# EAGLE schematic tiny_tht_encoder_board (EAGLE 9.4.2)

## Sheet 1 of 3
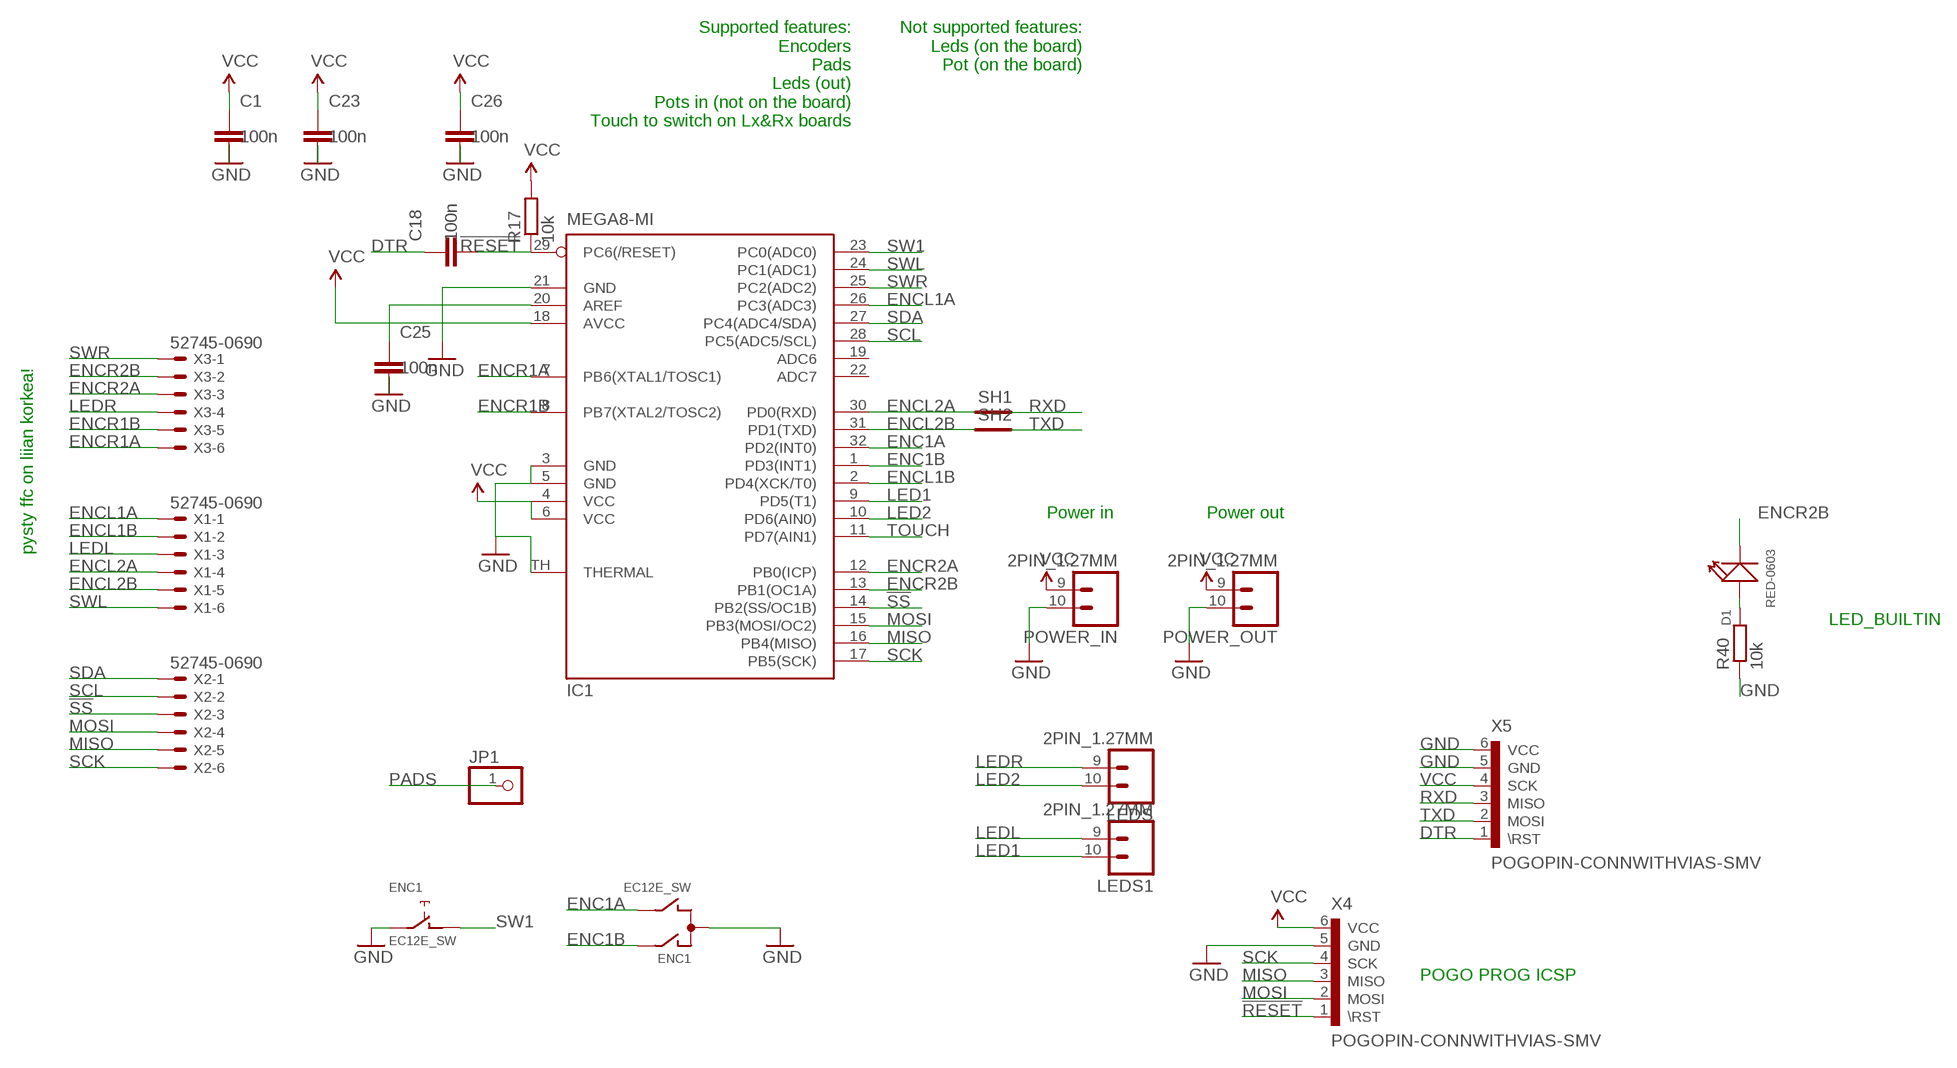
[diagram p0: schematic, sheet 1]

### Parts
C1  100n  C-EUC0402  [C0402]
C18  100n  C-EUC0402  [C0402]
C23  100n  C-EUC0402  [C0402]
C25  100n  C-EUC0402  [C0402]
C26  100n  C-EUC0402  [C0402]
D1  RED-0603  LED-SMD-RED-DIFFUSED(0603)  [LED-0603]
ENC1  EC12E_SW  [ALPS_EC12E_SW]
IC1  MEGA8-MI  [MLF32-TH]
JP1  PINHD-1X1  [1X01]
LEDS  2PIN_1.27MM  [1X02_1.27MM_NO_SILK]
LEDS1  2PIN_1.27MM  [1X02_1.27MM_NO_SILK]
POWER_IN  2PIN_1.27MM  [1X02_1.27MM_NO_SILK]
POWER_OUT  2PIN_1.27MM  [1X02_1.27MM_NO_SILK]
R17  10k  R-EU_R0402  [R0402]
R40  10k  R-EU_R0402  [R0402]
SH1  SHORT  [SHORT_TOP_8MIL]
SH2  SHORT  [SHORT_TOP_8MIL]
X1  52745-0690  [52745-0690]
X2  52745-0690  [52745-0690]
X3  52745-0690  [52745-0690]
X4  POGOPIN-CONNWITHVIAS-SMV  [POGOPROG-CONN-OH-SMALLERVIAS]
X5  POGOPIN-CONNWITHVIAS-SMV  [POGOPROG-CONN-OH-SMALLERVIAS]

### Nets
!RESET: C18.2 IC1.29(PC6(/RESET)) R17.1 X4.1(\RST)
!SS: IC1.14(PB2(SS/OC1B)) X2.3
AREF: C25.1 IC1.20(AREF)
DTR: C18.1 X5.1(\RST)
ENC1A: ENC1.B IC1.32(PD2(INT0)) ; also sheet 3
ENC1B: ENC1.A IC1.1(PD3(INT1)) ; also sheet 3
ENCL1A: IC1.26(PC3(ADC3)) X1.1 ; also sheet 3
ENCL1B: IC1.2(PD4(XCK/T0)) X1.2 ; also sheet 3
ENCL2A: IC1.30(PD0(RXD)) SH1.P$1 X1.4 ; also sheet 3
ENCL2B: IC1.31(PD1(TXD)) SH2.P$1 X1.5 ; also sheet 3
ENCR1A: IC1.7(PB6(XTAL1/TOSC1)) X3.6 ; also sheet 3
ENCR1B: IC1.8(PB7(XTAL2/TOSC2)) X3.5 ; also sheet 3
ENCR2A: IC1.12(PB0(ICP)) X3.3 ; also sheet 3
ENCR2B: D1.- IC1.13(PB1(OC1A)) X3.2 ; also sheet 3
GND: C1.2 C23.2 C25.2 C26.2 ENC1.C ENC1.E IC1.3(GND) IC1.5(GND) IC1.21(GND) IC1.TH(THERMAL) POWER_IN.10 POWER_OUT.10 R40.1 X4.5(GND) X5.5(GND) X5.6(VCC) ; also sheet 2
LED1: IC1.9(PD5(T1)) LEDS1.10
LED2: IC1.10(PD6(AIN0)) LEDS.10
LEDL: LEDS1.9 X1.3
LEDR: LEDS.9 X3.4
MISO: IC1.16(PB4(MISO)) X2.5 X4.3(MISO) ; also sheet 2
MOSI: IC1.15(PB3(MOSI/OC2)) X2.4 X4.2(MOSI) ; also sheet 2
N$31: D1.+ R40.2
PADS: JP1.1 ; also sheet 3
RXD: SH1.P$2 X5.3(MISO)
SCK: IC1.17(PB5(SCK)) X2.6 X4.4(SCK) ; also sheet 2
SCL: IC1.28(PC5(ADC5/SCL)) X2.2
SDA: IC1.27(PC4(ADC4/SDA)) X2.1
SW1: ENC1.D IC1.23(PC0(ADC0)) ; also sheet 3
SWL: IC1.24(PC1(ADC1)) X1.6 ; also sheet 3
SWR: IC1.25(PC2(ADC2)) X3.1 ; also sheet 3
TOUCH: IC1.11(PD7(AIN1))
TXD: SH2.P$2 X5.2(MOSI)
VCC: C1.1 C23.1 C26.1 IC1.4(VCC) IC1.6(VCC) IC1.18(AVCC) POWER_IN.9 POWER_OUT.9 R17.2 X4.6(VCC) X5.4(SCK)
Unconnected: ENC1.GND1(G) ENC1.GND2(G) IC1.19(ADC6) IC1.22(ADC7)

### Notes on the sheet
- Supported features:
  Encoders
  Pads
  Leds (out)
  Pots in (not on the board)
  Touch to switch on Lx&Rx boards
- Not supported features:
  Leds (on the board)
  Pot (on the board)
- Power in | Power out
- pysty ffc on liian korkea!
- LED_BUILTIN
- POGO PROG ICSP

## Sheet 2 of 3
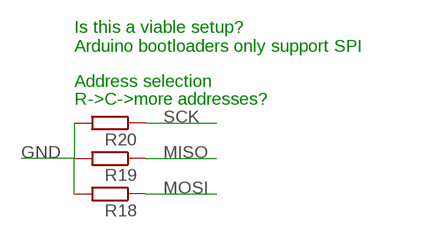
[diagram p1: schematic, sheet 2]

### Parts
R18  R-EU_R0402  [R0402]
R19  R-EU_R0402  [R0402]
R20  R-EU_R0402  [R0402]

### Nets
GND: R18.2 R19.2 R20.2 ; also sheet 1
MISO: R19.1 ; also sheet 1
MOSI: R18.1 ; also sheet 1
SCK: R20.1 ; also sheet 1

### Notes on the sheet
- Is this a viable setup?
  Arduino bootloaders only support SPI
- Address selection
- R->C->more addresses?

## Sheet 3 of 3
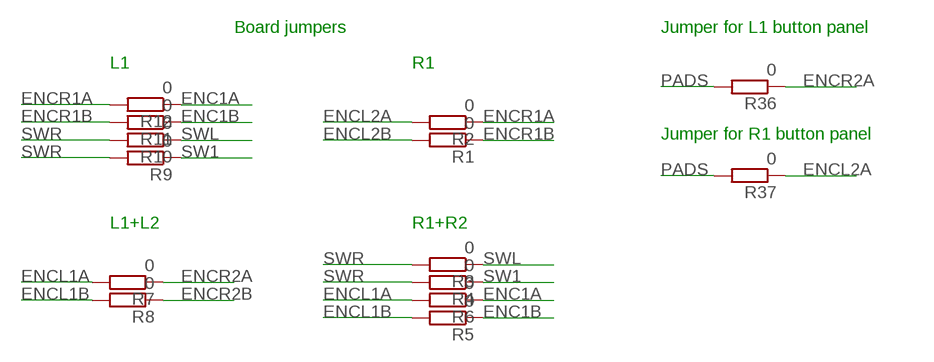
[diagram p2: schematic, sheet 3]

### Parts
R1  0  R-EU_R0603  [R0603]
R2  0  R-EU_R0603  [R0603]
R3  0  R-EU_R0603  [R0603]
R4  0  R-EU_R0603  [R0603]
R5  0  R-EU_R0603  [R0603]
R6  0  R-EU_R0603  [R0603]
R7  0  R-EU_R0603  [R0603]
R8  0  R-EU_R0603  [R0603]
R9  0  R-EU_R0603  [R0603]
R10  0  R-EU_R0603  [R0603]
R11  0  R-EU_R0603  [R0603]
R12  0  R-EU_R0603  [R0603]
R36  0  R-EU_R0402  [R0402]
R37  0  R-EU_R0402  [R0402]

### Nets
ENC1A: R6.1 R12.1 ; also sheet 1
ENC1B: R5.1 R11.1 ; also sheet 1
ENCL1A: R6.2 R7.2 ; also sheet 1
ENCL1B: R5.2 R8.2 ; also sheet 1
ENCL2A: R2.2 R37.1 ; also sheet 1
ENCL2B: R1.2 ; also sheet 1
ENCR1A: R2.1 R12.2 ; also sheet 1
ENCR1B: R1.1 R11.2 ; also sheet 1
ENCR2A: R7.1 R36.1 ; also sheet 1
ENCR2B: R8.1 ; also sheet 1
PADS: R36.2 R37.2 ; also sheet 1
SW1: R4.1 R9.1 ; also sheet 1
SWL: R3.1 R10.1 ; also sheet 1
SWR: R3.2 R4.2 R9.2 R10.2 ; also sheet 1

### Notes on the sheet
- Board jumpers | Jumper for L1 button panel
- L1 | R1
- Jumper for R1 button panel
- L1+L2 | R1+R2

## Library data of the parts
C1 C18 C23 C25 C26 = rcl:C-EU: CAPACITOR, European symbol; SPICEPREFIX: C
D1 = Seeed-LED-2016:LED-SMD-RED-DIFFUSED(0603): 304090042; MPN: 19-217-R6C-AL1M2VY-3T
ENC1 = switch_pec:EC12E_SW: ALPS rotary Encoder EC12E series with switch; MPN: EC12E2424407; OC_FARNELL: 1520813; OC_NEWARK: 74M1068
IC1 = atmel:MEGA8-MI: MICROCONTROLLER 8 Kbytes FLASH, 1 kbytes SRAM, 512 bytes EEPROM, USART, 6-channel 10 bit ADC, 2-channel 8 bit ADC Pin compatible with Atmega48, ATMega88, ATMega168 Source: avr.lbr; MPN: ATMEGA88PA-MU; OC_FARNELL: 1715491; OC_NEWARK: 15R0272
JP1 = pinhead_plus:PINHD-1X1: PIN HEADER
LEDS LEDS1 POWER_IN POWER_OUT = edge:2PIN_1.27MM
R1-R12 R17-R20 R36 R37 R40 = rcl:R-EU_: RESISTOR, European symbol; SPICEPREFIX: R
SH1 SH2 = shorts:SHORT: Short between two nets
X1-X3 = i2c_encoder:52745-0690: FFC/FPC-to-Board 0.50mm (.020") SMT Top Contact Right Angle, ZIF, Style Receptacle 52745 / 52435 Source: http://www.molex.com/product/ffc/52745.html; MF: MOLEX; MPN: 52745-0690; OC_FARNELL: unknown; OC_NEWARK: 92M6374
X4 X5 = Protofusion:POGOPIN-CONN: Protofusion custom pogo pin programming header